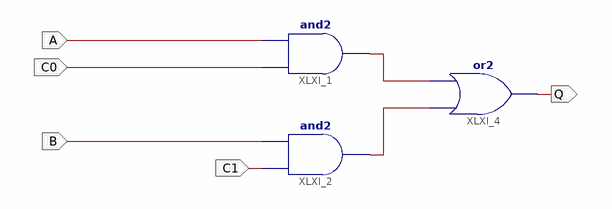
[diagram p0: schematic sheet 1]
// Xilinx ISE schematic Mux2_1.sch (spartan3e) as structural Verilog: 3 symbols, 5 ports
module Mux2_1 (
  input  A,
  input  B,
  input  C0,
  input  C1,
  output Q
);

  wire XLXN_9, XLXN_10;

  and XLXI_1 (XLXN_9, C0, A);
  and XLXI_2 (XLXN_10, C1, B);
  or XLXI_4 (Q, XLXN_10, XLXN_9);
endmodule
